# EasyEDA Pro project ProPrj_农_2025-09-07.epro, board PCB3
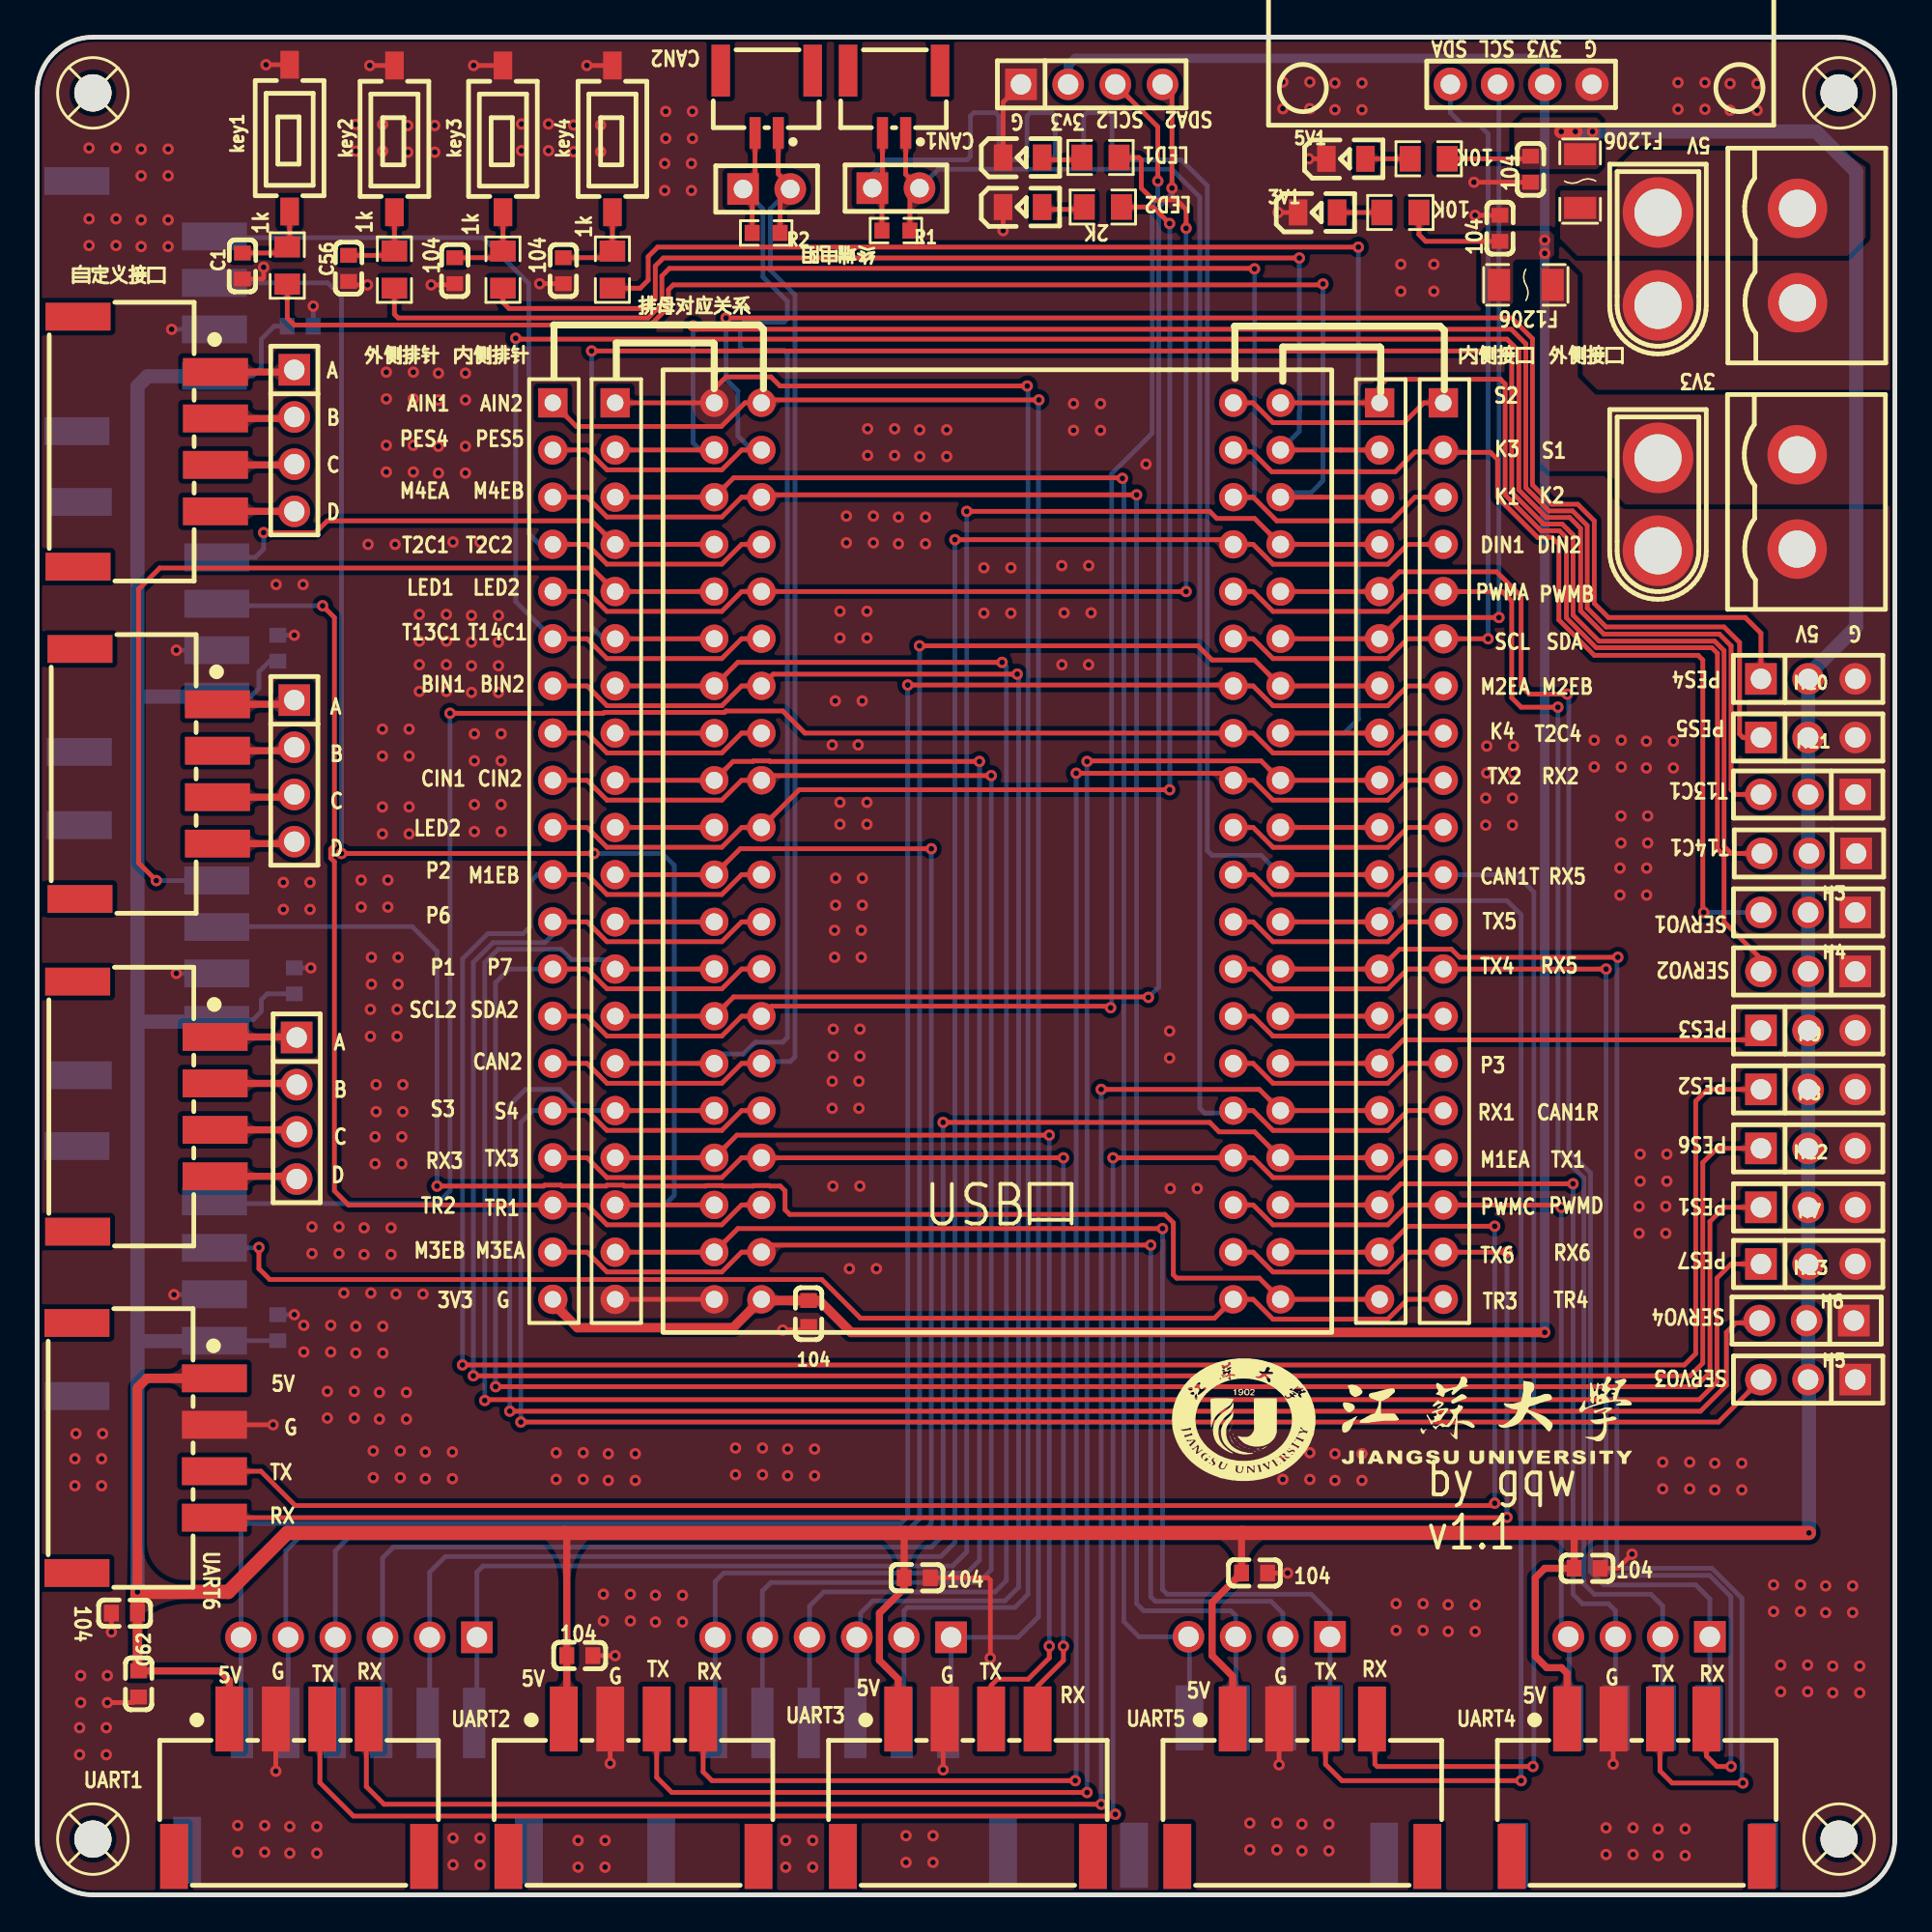
[diagram p8: board, top side]
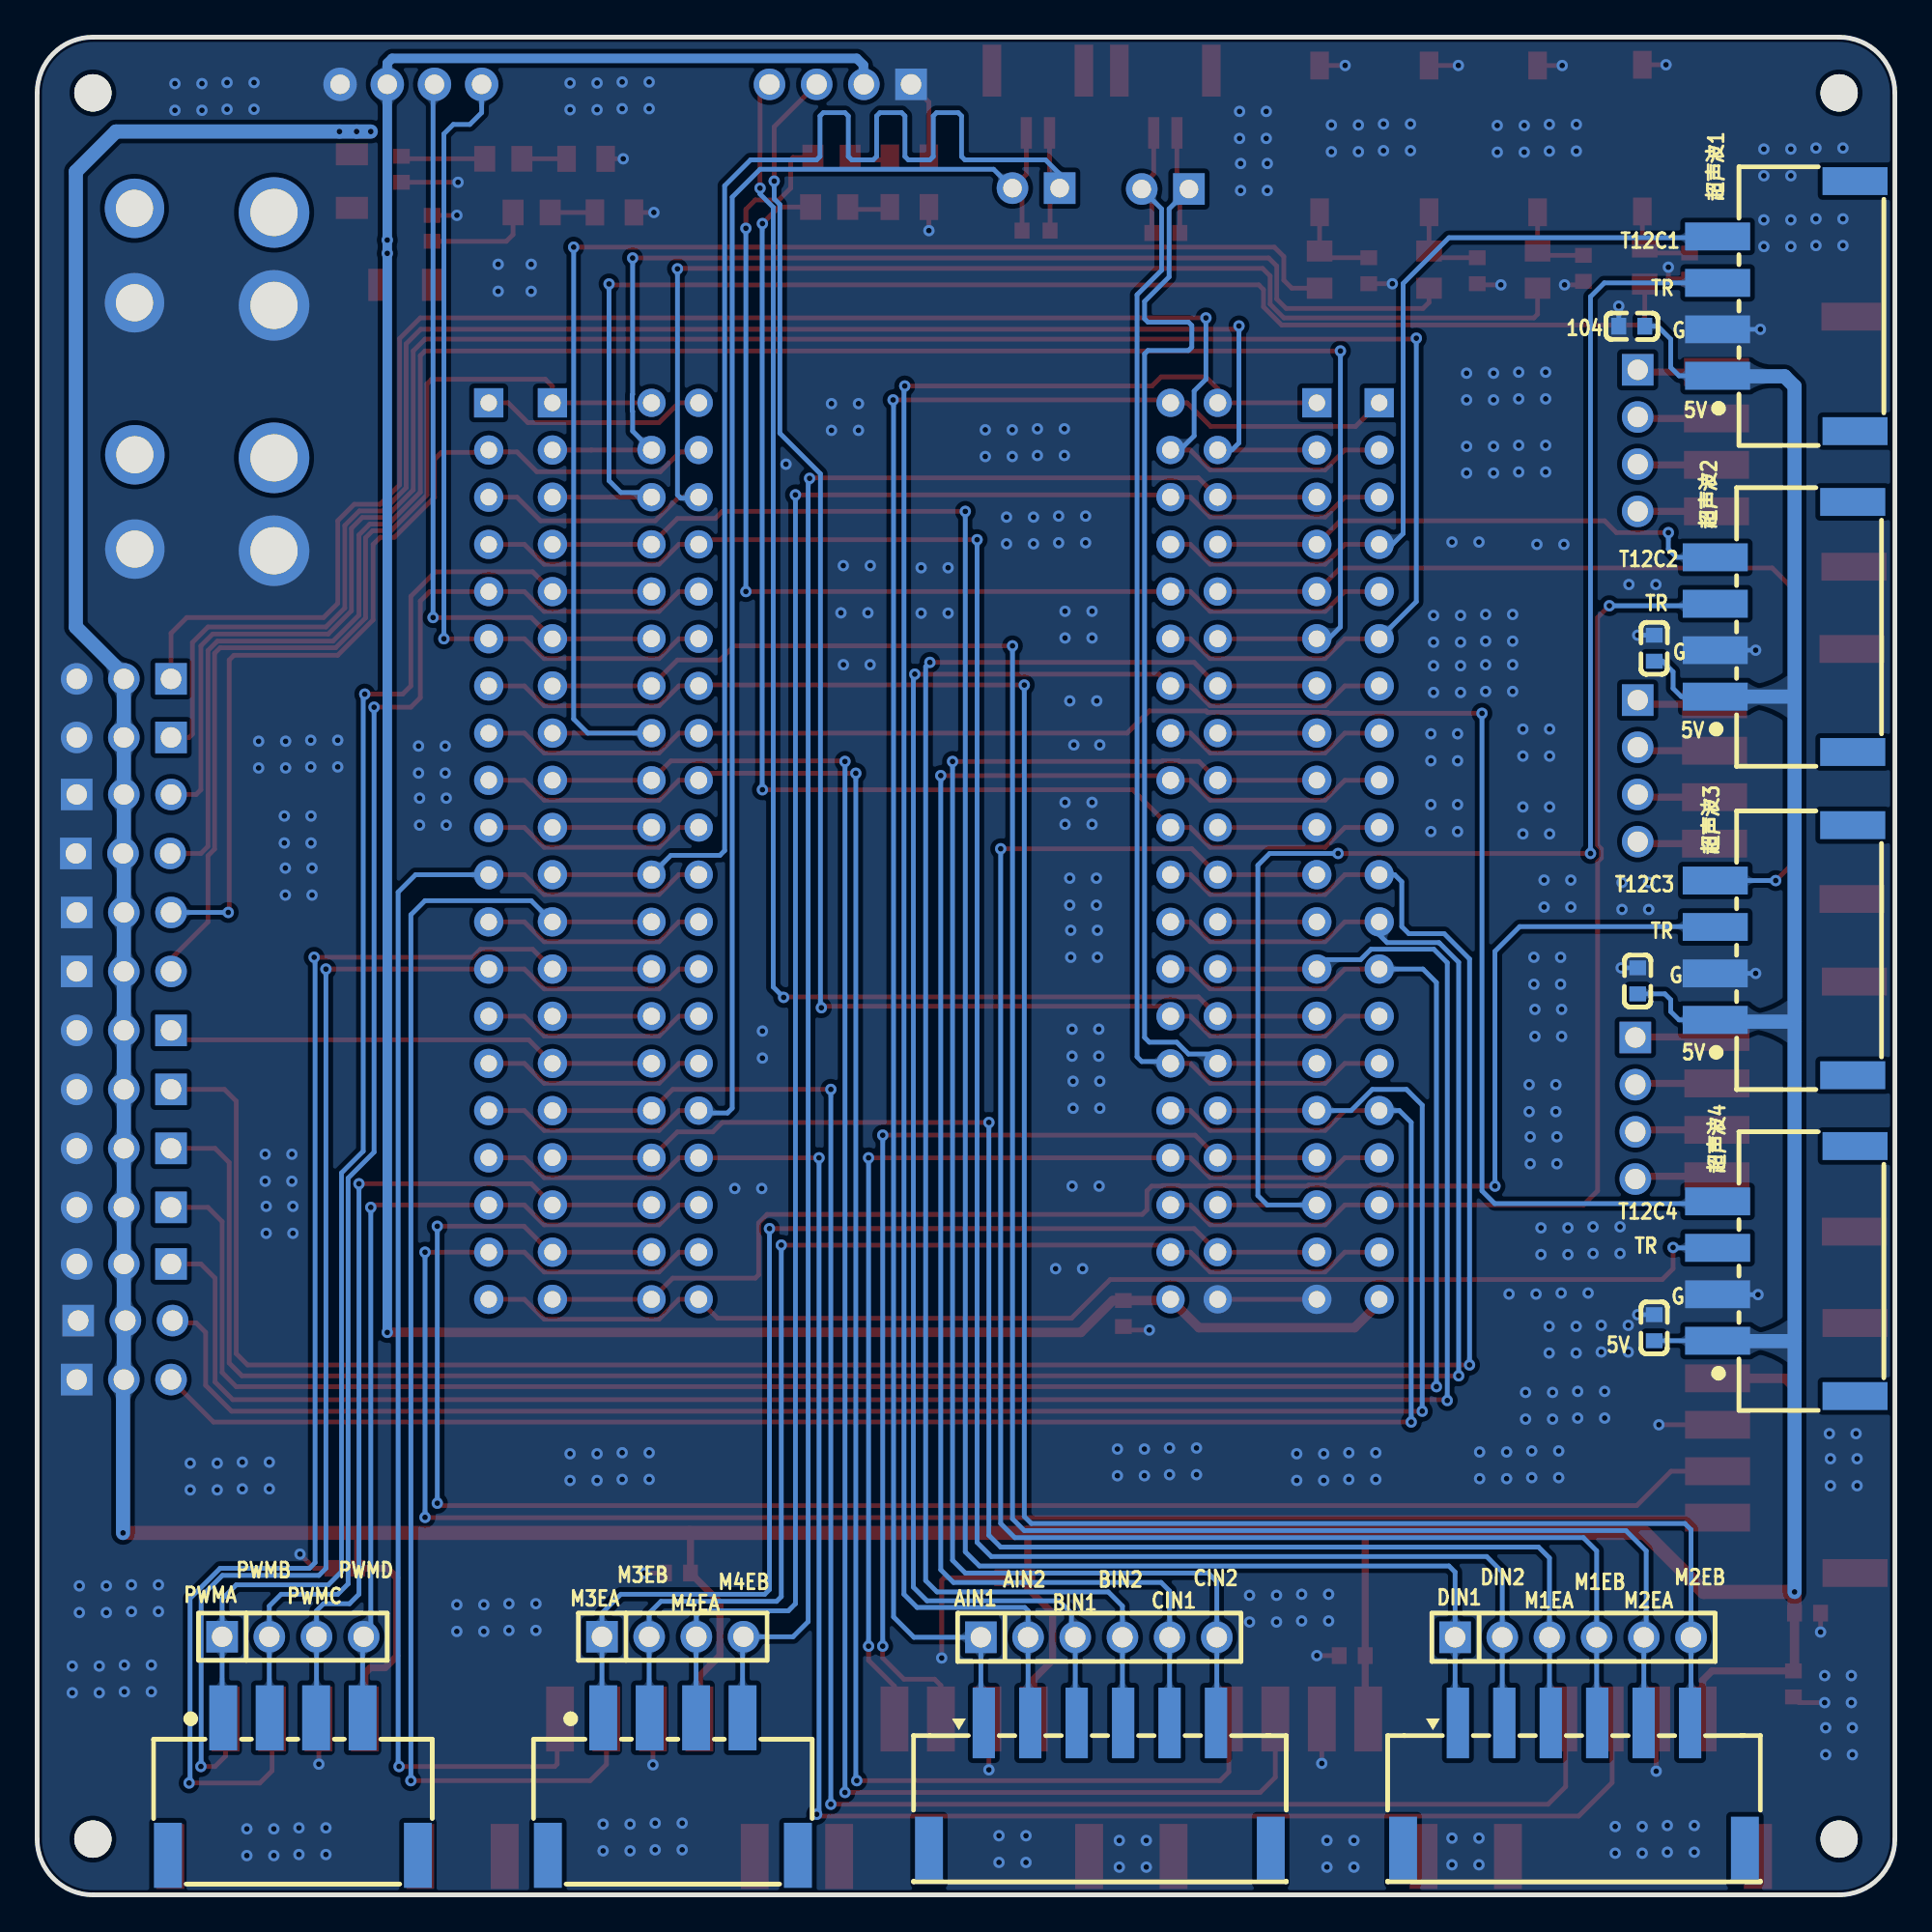
[diagram p9: board, bottom side, seen from below]

Outline 100 x 100 mm; copper layers: Top Layer, Bottom Layer. Coordinates in mm from the lower left corner of the outline.
Outline path: 0,97 0,3 arc(0.88,0.88) 3,0 97,0 arc(99.12,0.88) 100,3 100,97 arc(99.12,99.12) 97,100 3,100 arc(0.88,99.12) 0,97
Stack: Top Layer 0.035mm / Dielectric1 1.51mm FR4 er 4.5 / Bottom Layer 0.035mm

## Design rules (mm)
net CAN1_TX: DP2
net CAN1_RX: DP2
net CAN2_TX: DP1
net CAN2_RX: DP1
template: 自定义配置
spacing copperThickness1oz (default): track to track 0.102, other pairs 0.152 to 0.3
spacing copperThickness2oz: track to track 0.203, other pairs 0.152 to 0.3
track width copperThickness1oz (default): min 0.127, default 0.254, max 2.54
track width copperThickness2oz: min 0.203, default 0.254, max 2.54
differential pair differentialPair (default): width min 0.127, default 0.254, max 2.54; gap min 0.152, default 0.152
via viaSize (default): diameter min 0.5, default 0.61, max 10; hole min 0.3, default 0.305, max 6.299

## Placement (name value [footprint] x y rotation side)
3V1  NCD0805R1  [LED0805-R-RD]  68.93 90.56 0 top
5V1  NCD0805R1  [LED0805-R-RD]  70.45 93.45 0 top
104  104  [C0603]  41.53 31.29 90 top
C1  104  [C0603]  11.05 87.68 270 top
C13  104  [C0603]  78.74 89.71 270 top
C42  104  [C0603]  83.44 17.58 0 top
C56  104  [C0603]  16.76 87.55 270 top
C57  104  [C0603]  22.48 87.43 270 top
C58  104  [C0603]  28.32 87.43 270 top
C61  104  [C0603]  65.53 17.32 0 top
C62  104  [C0603]  5.46 11.35 270 top
C63  104  [C0603]  29.21 12.88 0 top
C64  104  [C0603]  47.37 17.07 0 top
C65  104  [C0603]  4.7 15.16 180 top
C66  104  [C0603]  13.84 49.2 90 bottom
C67  104  [C0603]  12.95 30.53 90 bottom
C68  104  [C0603]  12.95 67.11 90 bottom
C69  104  [C0603]  14.16 84.44 0 bottom
C70  104  [C0603]  80.39 92.89 90 top
CN17  WAFER-GH1.25-2PLB  [CONN-TH_2P-P1.25_XUNPU_WAFER-GH1.25-2PLB]  46.13 96.52 180 top
CN50  DB2EVC-5.08-2P-GN  [CONN-TH_2P-P5.08_DB2EVC-5.08-2P]  94.74 74.98 90 top
CN51  DB2EVC-5.08-2P-GN  [CONN-TH_2P-P5.08_DB2EVC-5.08-2P]  94.76 88.24 90 top
CN57  XT30U-M  [CONN-TH_XT30U-M]  87.25 88.06 270 top
CN59  XT30U-M  [CONN-TH_XT30U-M]  87.25 74.85 270 top
CN61  WAFER-XH2.54-4PWB  [CONN-TH_4P-P0.20_XUNPU_WAFER-XH2.54-4PWB]  86.23 5.83 180 bottom
CN62  WAFER-XH2.54-4PWB  [CONN-TH_4P-P0.20_XUNPU_WAFER-XH2.54-4PWB]  65.78 5.83 180 bottom
CN64  WAFER-GH1.25-2PLB  [CONN-TH_2P-P1.25_XUNPU_WAFER-GH1.25-2PLB]  39.27 96.52 180 top
CN65  WAFER-XH2.54-4PWB  [CONN-TH_4P-P0.20_XUNPU_WAFER-XH2.54-4PWB]  32.1 5.77 0 top
CN66  WAFER-XH2.54-4PWB  [CONN-TH_4P-P0.20_XUNPU_WAFER-XH2.54-4PWB]  50.1 5.77 0 top
CN67  WAFER-XH2.54-4PWB  [CONN-TH_4P-P0.20_XUNPU_WAFER-XH2.54-4PWB]  86.11 5.77 0 top
CN68  WAFER-XH2.54-4PWB  [CONN-TH_4P-P0.20_XUNPU_WAFER-XH2.54-4PWB]  68.1 5.77 0 top
CN69  WAFER-XH2.54-4PWB  [CONN-TH_4P-P0.20_XUNPU_WAFER-XH2.54-4PWB]  14.1 5.77 0 top
CN70  WAFER-XH2.54-4PWB  [CONN-TH_4P-P0.20_XUNPU_WAFER-XH2.54-4PWB]  5.84 24.05 270 top
CN72  WAFER-XH2.54-4PWB  [CONN-TH_4P-P0.20_XUNPU_WAFER-XH2.54-4PWB]  6.01 60.34 270 top
CN73  WAFER-XH2.54-4PWB  [CONN-TH_4P-P0.20_XUNPU_WAFER-XH2.54-4PWB]  5.88 42.43 270 top
CN75  WAFER-XH2.54-4PWB  [CONN-TH_4P-P0.20_XUNPU_WAFER-XH2.54-4PWB]  5.9 78.22 270 top
CN77  WAFER-XH2.54-4PWB  [CONN-TH_4P-P0.20_XUNPU_WAFER-XH2.54-4PWB]  5.84 85.52 90 bottom
CN78  WAFER-XH2.54-4PWB  [CONN-TH_4P-P0.20_XUNPU_WAFER-XH2.54-4PWB]  5.97 50.85 90 bottom
CN79  WAFER-XH2.54-4PWB  [CONN-TH_4P-P0.20_XUNPU_WAFER-XH2.54-4PWB]  5.97 68.25 90 bottom
CN80  WAFER-XH2.54-4PWB  [CONN-TH_4P-P0.20_XUNPU_WAFER-XH2.54-4PWB]  5.84 33.58 90 bottom
H3  PZ254V-11-03P  [HDR-TH_3P-P2.54-V-M]  95.33 52.88 180 top
H4  PZ254V-11-03P  [HDR-TH_3P-P2.54-V-M]  95.33 49.71 180 top
H5  PZ254V-11-03P  [HDR-TH_3P-P2.54-V-M]  95.33 27.74 180 top
H6  PZ254V-11-03P  [HDR-TH_3P-P2.54-V-M]  95.25 30.91 180 top
H7  PZ254V-11-03P  [HDR-TH_3P-P2.54-V-M]  95.33 37.01 0 top
H8  PZ254V-11-03P  [HDR-TH_3P-P2.54-V-M]  95.33 43.36 0 top
H9  PZ254V-11-03P  [HDR-TH_3P-P2.54-V-M]  95.33 46.53 0 top
H10  PZ254V-11-03P  [HDR-TH_3P-P2.54-V-M]  95.33 65.46 0 top
H11  PZ254V-11-03P  [HDR-TH_3P-P2.54-V-M]  95.33 62.3 0 top
H12  PZ254V-11-03P  [HDR-TH_3P-P2.54-V-M]  95.33 40.18 0 top
H13  PZ254V-11-03P  [HDR-TH_3P-P2.54-V-M]  95.33 33.96 0 top
H14  PZ254V-11-04P  [HDR-TH_4P-P2.54-V-M]  56.77 97.46 0 top
H15  -  [HDR-TH_2P-P2.54-V-F]  46.23 91.87 0 top
H16  -  [HDR-TH_2P-P2.54-V-F]  39.27 91.83 0 top
H17  PZ254V-11-04P  [HDR-TH_4P-P2.54-V-M]  86.23 13.89 180 bottom
H18  PZ254V-11-04P  [HDR-TH_4P-P2.54-V-M]  65.79 13.89 180 bottom
H19  2.54-1*6-BLUE  [HDR-TH_6P-P2.54-V-M_BLUE]  17.32 13.86 180 bottom
H20  2.54-1*6-BLUE  [HDR-TH_6P-P2.54-V-M_BLUE]  42.85 13.86 180 bottom
H21  PZ254V-11-04P  [HDR-TH_4P-P2.54-V-M]  13.84 60.5 270 top
H22  PZ254V-11-04P  [HDR-TH_4P-P2.54-V-M]  13.97 42.34 270 top
H23  PZ254V-11-03P  [HDR-TH_3P-P2.54-V-M]  95.33 59.23 180 top
H24  PZ254V-11-03P  [HDR-TH_3P-P2.54-V-M]  95.38 56.06 180 top
H26  PZ254V-11-04P  [HDR-TH_4P-P2.54-V-M]  13.84 78.28 270 top
J1  HDR-M-2.54_1x20  [HDR-M-2.54_1X20]  31.12 56.19 270 top
J2  HDR-M-2.54_1x20  [HDR-M-2.54_1X20]  27.76 56.19 270 top
J3  HDR-M-2.54_1x20  [HDR-M-2.54_1X20]  75.69 56.19 270 top
J4  HDR-M-2.54_1x20  [HDR-M-2.54_1X20]  72.26 56.19 270 top
key1  TS-1092S-B3D2-G  [SW-SMD_L6.1-W3.6-LS7.9]  13.59 94.56 90 top
key2  TS-1092S-B3D2-G  [SW-SMD_L6.1-W3.6-LS7.9]  19.23 94.52 90 top
key3  TS-1092S-B3D2-G  [SW-SMD_L6.1-W3.6-LS7.9]  25.07 94.52 90 top
key4  TS-1092S-B3D2-G  [SW-SMD_L6.1-W3.6-LS7.9]  30.97 94.52 90 top
LED1  NCD0805R1  [LED0805-R-RD]  53.05 93.52 0 top
LED2  NCD0805R1  [LED0805-R-RD]  53.05 90.86 0 top
R1  120  [R0603]  46.23 89.59 180 top
R2  120  [R0603]  39.24 89.46 180 top
R6_1k1  1K  [R0805]  13.46 87.71 90 top
R7_1K1  1K  [R0805]  19.23 87.49 90 top
R8_1K1  1K  [R0805]  25.07 87.49 90 top
R10_2K1  2K  [R0805]  57.37 90.86 180 top
R10_10K1  10K  [R0805]  73.38 90.56 180 top
R13_2K1  2K  [R0805]  57.24 93.52 180 top
R13_10K1  10K  [R0805]  74.91 93.45 180 top
R31_1K1  1K  [R0805]  30.97 87.49 90 top
SCREW1  -  [M2螺丝]  97 3 0 top
SCREW2  -  [M2螺丝]  3 3 0 top
SCREW3  -  [M2螺丝]  97 97 0 top
SCREW4  -  [M2螺丝]  3 97 0 top
U1  -  [stm32f4最小]  33.69 82.09 0 top
U31  HS96L03W2C03  [OLED-TH_L27.8-W27.2-P2.54_C9900033791]  79.88 97.46 180 top
U35  2.54-6PWT  [COMM-SMD_6P-P2.50_SHOUHAN_2.54-6PWT]  42.79 5.83 180 bottom
U36  2.54-6PWT  [COMM-SMD_6P-P2.50_SHOUHAN_2.54-6PWT]  17.27 5.83 180 bottom
U37  1.5A快恢复保险丝-1206  [F1206]  80.14 86.67 180 top
U38  1.5A快恢复保险丝-1206  [F1206]  83.06 92.25 90 top

## Footprints (pads in the part's own frame, mm; a bottom-side part is the same pattern mirrored in y, then rotated)
C0603
  rect 0.8x0.9 smd: 1(-0.7,0) 2(0.7,0)
COMM-SMD_6P-P2.50_SHOUHAN_2.54-6PWT
  rect 1.2x3.8 smd: 1(-6.25,3.425) 2(-3.75,3.425) 3(-1.25,3.425) 4(1.25,3.425) 5(3.75,3.425) 6(6.25,3.425)
  rect 1.5x3.6 smd: 7(9.2,-3.425) 8(-9.2,-3.425)
CONN-TH_2P-P1.25_XUNPU_WAFER-GH1.25-2PLB
  rect 0.6x1.7 smd: 1(-0.625,1.675) 2(0.625,1.675)
  rect 1x2.8 smd: 3(2.475,-1.675) 4(-2.475,-1.675)
CONN-TH_2P-P5.08_DB2EVC-5.08-2P
  round 3.2 hole 2: 1(-2.54,0) 2(2.54,0)
CONN-TH_4P-P0.20_XUNPU_WAFER-XH2.54-4PWB
  rect 1.5x3.5 smd: 1(-3.75,3.7) 2(-1.25,3.7) 3(1.25,3.7) 4(3.75,3.7) 5(-6.73,-3.7) 6(6.73,-3.7)
CONN-TH_XT30U-M
  round 3.8 hole 2.54: 1(-2.5,0) 2(2.5,0)
F1206
  rect 1.19x1.728 smd: 1(-1.445,0) 2(1.445,0)
HDR-M-2.54_1X20
  rect 1.575x1.575 hole 0.889: 1(-24.13,0)
  round 1.575 hole 0.889: 2(-21.59,0) 3(-19.05,0) 4(-16.51,0) 5(-13.97,0) 6(-11.43,0) 7(-8.89,0) 8(-6.35,0) 9(-3.81,0) 10(-1.27,0) 11(1.27,0) 12(3.81,0) 13(6.35,0) 14(8.89,0) 15(11.43,0) 16(13.97,0) 17(16.51,0) 18(19.05,0) 19(21.59,0) 20(24.13,0)
HDR-TH_2P-P2.54-V-F
  rect 1.7x1.7 hole 1: 1(-1.27,0)
  round 1.7 hole 1: 2(1.27,0)
HDR-TH_3P-P2.54-V-M
  rect 1.7x1.7 hole 1.1: 1(-2.54,0)
  round 1.7 hole 1.1: 2(0,0) 3(2.54,0)
HDR-TH_4P-P2.54-V-M
  rect 1.7x1.7 hole 1.1: 1(-3.81,0)
  round 1.7 hole 1.1: 2(-1.27,0) 3(1.27,0) 4(3.81,0)
HDR-TH_6P-P2.54-V-M_BLUE
  rect 1.7x1.7 hole 1.1: 1(-6.35,0)
  round 1.7 hole 1.1: 2(-3.81,0) 3(-1.27,0) 4(1.27,0) 5(3.81,0) 6(6.35,0)
LED0805-R-RD
  rect 1x1.399 smd: 1(1.05,0) 2(-1.05,0)
M2螺丝
  round 2 hole 2: 1(0,0)
OLED-TH_L27.8-W27.2-P2.54_C9900033791
  round 1.8 hole 1.05: 1(-3.81,0) 2(-1.27,0) 3(1.27,0) 4(3.81,0)
R0603
  rect 0.806x0.864 smd: 1(-0.753,0) 2(0.753,0)
R0805
  rect 1.133x1.377 smd: 1(-1,0) 2(1,0)
stm32f4最小
  round 1.524 hole 0.914: 1(2.76,-1.778) 2(2.76,-4.318) 3(2.76,-6.858) 4(2.76,-9.398) 5(2.76,-11.938) 6(2.76,-14.478) 7(2.76,-17.018) 8(2.76,-19.558) 9(2.76,-22.098) 10(2.76,-24.638) 11(2.76,-27.178) 12(2.76,-29.718) 13(2.76,-32.258) 14(2.76,-34.798) 15(2.76,-37.338) 16(2.76,-39.878) 17(2.76,-42.418) 18(2.76,-44.958) 19(2.76,-47.498) 20(2.76,-50.038) 21(5.3,-1.778) 22(5.3,-4.318) 23(5.3,-6.858) 24(5.3,-9.398) 25(5.3,-11.938) 26(5.3,-14.478) 27(5.3,-17.018) 28(5.3,-19.558) 29(5.3,-22.098) 30(5.3,-24.638) 31(5.3,-27.178) 32(5.3,-29.718) 33(5.3,-32.258) 34(5.3,-34.798) 35(5.3,-37.338) 36(5.3,-39.878) 37(5.3,-42.418) 38(5.3,-44.958) 39(5.3,-47.498) 40(5.3,-50.038) 41(30.7,-1.778) 42(30.7,-4.318) 43(30.7,-6.858) 44(30.7,-9.398) 45(30.7,-11.938) 46(30.7,-14.478) 47(30.7,-17.018) 48(30.7,-19.558) 49(30.7,-22.098) 50(30.7,-24.638) 51(30.7,-27.178) 52(30.7,-29.718) 53(30.7,-32.258) 54(30.7,-34.798) 55(30.7,-37.338) 56(30.7,-39.878) 57(30.7,-42.418) 58(30.7,-44.958) 59(30.7,-47.498) 60(30.7,-50.038) 61(33.24,-1.778) 62(33.24,-4.318) 63(33.24,-6.858) 64(33.24,-9.398) 65(33.24,-11.938) 66(33.24,-14.478) 67(33.24,-17.018) 68(33.24,-19.558) 69(33.24,-22.098) 70(33.24,-24.638) 71(33.24,-27.178) 72(33.24,-29.718) 73(33.24,-32.258) 74(33.24,-34.798) 75(33.24,-37.338) 76(33.24,-39.878) 77(33.24,-42.418) 78(33.24,-44.958) 79(33.24,-47.498) 80(33.24,-50.038)
SW-SMD_L6.1-W3.6-LS7.9
  rect 1.5x1 smd: 1(-3.95,0) 2(3.95,0)

## Nets
3V3: 104.2 C13.2 H14.2 J2.20 R10_10K1.1 U1.40 U31.2 U37.2
5V: C42.1 C61.1 C62.1 C63.1 C64.1 C65.1 C66.1 C67.1 C68.1 C69.1 C70.2 CN65.1 CN66.1 CN67.1 CN68.1 CN69.1 CN70.1 CN77.1 CN78.1 CN79.1 CN80.1 H3.2 H4.2 H5.2 H6.2 H7.2 H8.2 H9.2 H10.2 H11.2 H12.2 H13.2 H23.2 H24.2 R13_10K1.1 U38.2
GND: 3V1.2 5V1.2 104.1 C1.2 C13.1 C42.2 C56.2 C57.2 C58.2 C61.2 C62.2 C63.2 C64.2 C65.2 C66.2 C67.2 C68.2 C69.2 C70.1 CN50.1 CN51.1 CN57.2 CN59.2 CN65.2 CN66.2 CN67.2 CN68.2 CN69.2 CN70.2 CN77.2 CN78.2 CN79.2 CN80.2 H3.1 H4.1 H5.1 H6.1 H7.3 H8.3 H9.3 H10.3 H11.3 H12.3 H13.3 H14.1 H23.1 H24.1 J1.20 key1.2 key2.2 key3.2 key4.2 LED1.2 LED2.2 U1.20 U31.1
AIN1: H20.1 J2.1 U1.21 U35.1
AIN2: H20.2 J1.1 U1.1 U35.2
BIN1: H20.3 J2.7 U1.27 U35.3
BIN2: H20.4 J1.7 U1.7 U35.4
CAN1_RX: CN17.1 H15.2 J3.16 R1.1 U1.56
CAN1_TX: CN17.2 H15.1 J4.11 R1.2 U1.71
CAN2_RX: CN64.1 H16.2 J2.15 R2.1 U1.35
CAN2_TX: CN64.2 H16.1 J1.15 R2.2 U1.15
CIN1: H20.5 J2.9 U1.29 U35.5
CIN2: H20.6 J1.9 U1.9 U35.6
DIN1: H19.1 J4.4 U1.64 U36.1
DIN2: H19.2 J3.4 U1.44 U36.2
KEY1: J4.3 R6_1k1.1 U1.63
KEY2: J3.3 R7_1K1.1 U1.43
KEY3: J4.2 R8_1K1.1 U1.62
KEY4: J4.8 R31_1K1.1 U1.68
LED1: J2.5 R13_2K1.1 U1.25
LED2: J2.10 R10_2K1.1 U1.30
M1_ENCODER_A: H19.3 J4.17 U1.77 U36.3
M1_ENCODER_B: H19.4 J1.11 U1.11 U36.4
M2_ENCODER_A: H19.5 J4.7 U1.67 U36.5
M2_ENCODER_B: H19.6 J3.7 U1.47 U36.6
M3_ENCODER_A: CN62.1 H18.1 J1.19 U1.19
M3_ENCODER_B: CN62.2 H18.2 J2.19 U1.39
M4_ENCODER_A: CN62.3 H18.3 J2.3 U1.23
M4_ENCODER_B: CN62.4 H18.4 J1.3 U1.3
PES1: H7.1 J2.13 U1.33
PES2: H8.1 J2.11 U1.31
PES3: H9.1 J4.15 U1.75
PES4: H10.1 J2.2 U1.22
PES5: H11.1 J1.2 U1.2
PES6: H12.1 J2.12 U1.32
PES7: H13.1 J1.13 U1.13
PWMA: CN61.1 H17.1 J4.5 U1.65
PWMB: CN61.2 H17.2 J3.5 U1.45
PWMC: CN61.3 H17.3 J4.18 U1.78
PWMD: CN61.4 H17.4 J3.18 U1.58
RX1: CN69.4 J4.16 U1.76
RX2: CN65.4 J3.9 U1.49
RX3: CN66.4 J2.17 U1.37
RX4: CN67.4 J3.13 U1.53
RX5: CN68.4 J3.11 U1.51
RX6: CN70.4 J3.19 U1.59
SCL: J4.6 U1.66 U31.3
SCL2: H14.3 J2.14 U1.34
SDA: J3.6 U1.46 U31.4
SDA2: H14.4 J1.14 U1.14
SERVO1: H3.3 J3.2 U1.42
SERVO2: H4.3 J4.1 U1.61
SERVO3: H5.3 J2.16 U1.36
SERVO4: H6.3 J1.16 U1.16
T13C1: H23.3 J2.6 U1.26
T14C1: H24.3 J1.6 U1.6
TIM2C1: CN77.4 J2.4 U1.24
TIM2C2: CN79.4 J1.4 U1.4
TIM2C3: CN78.4 J1.5 U1.5
TIM2C4: CN80.4 J3.8 U1.48
TRIGGER1: CN77.3 J1.18 U1.18
TRIGGER2: CN79.3 J2.18 U1.38
TRIGGER3: CN78.3 J4.20 U1.80
TRIGGER4: CN80.3 J3.20 U1.60
TX1: CN69.3 J3.17 U1.57
TX2: CN65.3 J4.9 U1.69
TX3: CN66.3 J1.17 U1.17
TX4: CN67.3 J4.13 U1.73
TX5: CN68.3 J4.12 U1.72
TX6: CN70.3 J4.19 U1.79
USER1_A: CN72.1 H21.1
USER1_B: CN72.2 H21.2
USER1_C: CN72.3 H21.3
USER1_D: CN72.4 H21.4
USER2_A: CN73.1 H22.1
USER2_B: CN73.2 H22.2
USER2_C: CN73.3 H22.3
USER2_D: CN73.4 H22.4
USER3_A: CN75.1 H26.1
USER3_B: CN75.2 H26.2
USER3_C: CN75.3 H26.3
USER3_D: CN75.4 H26.4
$1N365: J3.14 U1.54
$1N367: J3.15 U1.55
$1N369: J4.14 U1.74
$1N397: J3.1 U1.41
$1N415: J1.10 U1.10
$1N423: J1.12 U1.12
$1N429: J2.8 U1.28
$1N431: J1.8 U1.8
$1N459: J3.12 U1.52
$1N465: J3.10 U1.50
$1N768: CN50.2 CN59.1 U37.1
$1N1772: CN51.2 CN57.1 U38.1
$1N5729: J4.10 U1.70
$1N6571: C1.1 key1.1 R6_1k1.2
$1N6572: C56.1 key2.1 R7_1K1.2
$1N6573: C57.1 key3.1 R8_1K1.2
$1N6581: C58.1 key4.1 R31_1K1.2
$1N6590: LED2.1 R10_2K1.2
$1N6594: LED1.1 R13_2K1.2
$1N12392: 3V1.1 R10_10K1.2
$1N12395: 5V1.1 R13_10K1.2

Pads without a net: CN17 3 4; CN61 5 6; CN62 5 6; CN64 3 4; CN65 5 6; CN66 5 6; CN67 5 6; CN68 5 6; CN69 5 6; CN70 5 6; CN72 5 6; CN73 5 6; CN75 5 6; CN77 5 6; CN78 5 6; CN79 5 6; CN80 5 6; SCREW1 1; SCREW2 1; SCREW3 1; SCREW4 1; U35 7 8; U36 7 8

## Via types
v1: diameter 0.61, hole 0.305, Top Layer to Bottom Layer, 505 vias

## Routing (per net, layer and track width the routed paths; a pad name or vN(x,y) marks a point on that pad's centre or on a via; arc(x,y) is an arc through that point)
3V3: length 156.5
  Top Layer w0.254: R10_10K1.1 74.38,89.37 74.74,89.01 C13.2
  Top Layer w0.508: J2.20 27.76,31.86 29.08,30.53 37.46,30.53 U1.40 39.05,31.99 104.2 42.1,31.99 43.81,30.28 v1(81.15,30.28)
  Bottom Layer w0.508: H14.2 55.52,97.48 55.52,98.5 55.88,98.86 80.9,98.86 81.15,98.6 v1(81.15,89.08) v1(81.15,88.36) v1(81.15,30.28)
5V: length 360.9
  Top Layer w0.254: R13_10K1.1 80.25,93.45 C70.2
  Top Layer w0.381: CN67.1 82.36,11.93 82.06,12.23 81.26,12.23 80.65,12.85 80.65,17.07 81.15,17.58 C42.1 82.74,19.44 82.78,19.48 ; 28.4,19.48 28.51,19.37 C63.1 28.51,9.63 28.35,9.47 ; 64.88,19.48 64.83,19.43 C61.1 63.25,15.74 63.25,12.88 64.35,11.77 CN68.1 ; C62.1 9.84,12.05 10.35,11.55 CN69.1 ; CN66.1 46.35,11.61 45.34,12.62 45.34,15.16 46.67,16.5 C64.1 46.67,19.47 46.69,19.48
  Top Layer w0.508: 5.46,27.36 5.91,27.8 CN70.1 ; C65.1 5.4,11.99 5.46,11.93 ; v1(5.4,16.31) 5.4,27.29
  Top Layer w0.762: v1(95.38,19.48) 13.46,19.48 10.29,16.31 v1(5.4,16.31) C65.1 ; v1(82.8,94.92) v1(82.04,94.92)
  Bottom Layer w0.254: C68.1 12.51,66.41 11.94,65.84 11.94,64.95 11.49,64.5 CN79.1 ; CN77.1 11.62,81.77 12.06,82.22 12.06,83.74 12.76,84.44 C69.1 ; 12.95,29.83 12.95,29.83 CN80.1 ; CN78.1 11.62,47.1 12.06,47.55 12.06,48.18 12.38,48.5 C66.1
  Bottom Layer w0.762: v1(82.04,94.92) v1(82.8,94.92) v1(83.73,94.92) 95.76,94.92 97.92,92.76 97.92,68.25 95.33,65.67 H10.2 H11.2 H23.2 H3.2 H4.2 H9.2 H8.2 H12.2 H7.2 H13.2 H5.2 ; 5.4,47.01 9.57,47.01 CN78.1 ; 5.4,47.01 5.4,64.5 ; 5.4,47.01 5.4,29.81 ; 5.4,64.5 CN79.1 ; 5.4,64.5 5.4,81.2 5.94,81.74 9.51,81.74 CN77.1 ; v1(5.4,16.31) 5.4,29.81 ; 5.4,29.81 9.52,29.81 CN80.1 ; 95.38,27.74 v1(95.38,19.48)
GND: length 67.8
  Top Layer w0.254: C58.2 v1(27.05,86.73) ; C63.2 v1(31.12,12.88) ; v1(40.13,30.4) 41.34,30.4 41.53,30.59 ; C61.2 v1(67.31,17.32) ; C13.1 v1(77.41,90.41) ; C70.1 v1(77.34,92.19) ; v1(21.21,86.67) 22.42,86.67 C57.2 ; C65.2 v1(4,14.15) ; 30.85,8.28 v1(30.85,7.08) ; 3V1.2 v1(66.8,90.56) ; 84.14,17.58 85.09,17.58 v1(85.85,18.34) ; U1.20 J1.20 ; key4.2 30.96,98.48 v1(29.59,98.48) ; C62.2 5.16,10.35 v1(3.78,10.35) ; key1.2 v1(12.32,98.51) ; 66.85,8.21 v1(66.85,7) ; LED2.2 v1(52,89.59) ; CN69.2 v1(12.85,6.66) ; v1(23.5,98.48) 25.07,98.48 key3.2 ; C56.2 16.95,86.67 v1(17.78,86.67) ; 48.77,7.99 v1(48.77,6.73) ; C64.2 51.18,17.07 51.31,16.94 v1(51.31,12.75) ; v1(12.19,87.62) 12.19,87.05 12.13,86.98 C1.2 ; key2.2 v1(17.91,98.47) ; 5V1.2 v1(68.45,93.45) ; CN70.2 v1(12.7,25.3) ; LED1.2 52,96.5 H14.1 ; 84.84,8.24 v1(84.84,7.04)
  Bottom Layer w0.254: C69.2 v1(14.86,85.52) ; C67.2 v1(13.84,31.23) ; CN79.2 v1(7.49,67) ; CN77.2 v1(7.24,84.27) ; C66.2 v1(14.73,49.9) ; C68.2 v1(13.84,67.81) ; v1(7.37,32.31) 9.52,32.31 CN80.2 ; CN78.2 v1(7.49,49.6)
  vias: v1(2.03,23.47) v1(2.03,22.02) v1(2.09,24.83) v1(2.34,11.8) v1(2.34,10.35) v1(2.29,9) v1(2.29,7.54) v1(2.79,94.03) v1(2.79,90.22) v1(2.79,88.78) v1(3.52,24.83) v1(3.47,23.47) v1(3.47,22.02) v1(3.72,9) v1(3.72,7.54) v1(3.78,11.8) v1(4.25,94.03) v1(4.25,90.22) v1(4.25,88.78) v1(5.6,93.98) v1(5.6,92.54) v1(5.6,90.17) v1(5.6,88.73) v1(7.05,93.98) v1(7.05,92.54) v1(7.05,90.17) v1(7.05,88.73) v1(10.8,3.73) v1(10.8,2.3) v1(12.25,3.73) v1(12.25,2.3) v1(12.86,70.54) v1(13.25,54.5) v1(13.25,53.05) v1(13.6,3.68) v1(13.6,2.24) v1(14.32,70.54) v1(14.35,30.66) v1(14.35,29.22) v1(14.69,54.5) v1(14.69,53.05) v1(14.79,35.96) v1(14.79,34.52) v1(15.05,3.68) v1(15.05,2.24) v1(15.62,27.1) v1(15.62,25.66) v1(15.8,30.66) v1(15.8,29.22) v1(16.25,35.96) v1(16.25,34.52) v1(16.51,32.4) v1(17.14,95.3) v1(17.14,93.86) v1(17.07,27.1) v1(17.07,25.66) v1(17.16,30.6) v1(17.16,29.17) v1(17.44,54.63) v1(17.44,53.17) v1(17.6,35.91) v1(17.6,34.47) v1(17.82,72.69) v1(17.94,47.67) v1(17.94,46.21) v1(17.99,50.47) v1(17.99,49.02) v1(17.96,32.4) v1(18.09,23.9) v1(18.09,22.46) v1(18.25,43.61) v1(18.25,42.16) v1(18.19,40.81) v1(18.19,39.35) v1(18.43,27.05) v1(18.43,25.61) v1(18.6,95.3) v1(18.6,93.86) v1(18.59,62.75) v1(18.59,61.3) v1(18.59,58.56) v1(18.59,57.11) v1(18.61,30.6) v1(18.61,29.17) v1(18.8,81.97) v1(18.8,80.53) v1(18.8,78.03) v1(18.8,76.59) v1(18.88,54.63) v1(18.88,53.17) v1(19.05,35.91) v1(19.05,34.47) v1(19.27,72.69) v1(19.31,32.34) v1(19.43,50.47) v1(19.43,49.02) v1(19.38,47.67) v1(19.38,46.21) v1(19.55,23.9) v1(19.55,22.46) v1(19.63,40.81) v1(19.63,39.35) v1(19.69,43.61) v1(19.69,42.16) v1(19.95,95.25) v1(19.95,93.81) v1(19.88,27.05) v1(19.88,25.61) v1(20.02,62.75) v1(20.02,61.3) v1(20.02,58.56) v1(20.02,57.11) v1(20.25,81.97) v1(20.25,80.53) v1(20.25,78.03) v1(20.25,76.59) v1(20.57,68.92) v1(20.57,67.49) v1(20.57,66.22) v1(20.57,64.78) v1(20.77,32.34) v1(20.9,23.84) v1(20.9,22.4) v1(21.4,95.25) v1(21.4,93.81) v1(21.6,81.91) v1(21.6,80.47) v1(21.6,77.97) v1(21.6,76.54) v1(22.03,68.92) v1(22.03,67.49) v1(22.03,66.22) v1(22.03,64.78) v1(22.39,72.82) v1(22.35,23.84) v1(22.35,22.4) v1(22.39,3.06) v1(22.39,1.62) v1(23.05,81.91) v1(23.05,80.47) v1(23.05,77.97) v1(23.05,76.54) v1(23.38,68.87) v1(23.38,67.43) v1(23.38,66.16) v1(23.38,64.73) v1(23.54,62.5) v1(23.54,61.05) v1(23.54,58.69) v1(23.54,57.24) v1(23.84,72.82) v1(23.84,3.06) v1(23.84,1.62) v1(24.83,68.87) v1(24.83,67.43) v1(24.83,66.16) v1(24.83,64.73) v1(24.98,62.5) v1(24.98,61.05) v1(24.98,58.69) v1(24.98,57.24) v1(26.07,95.33) v1(26.07,93.89) v1(27.53,95.33) v1(27.53,93.89) v1(27.94,23.8) v1(27.94,22.36) v1(28.88,95.27) v1(28.88,93.83) v1(29.12,2.93) v1(29.12,1.49) v1(29.39,23.8) v1(29.39,22.36) v1(30.33,95.27) v1(30.33,93.83) v1(30.48,16.18) v1(30.48,14.74) v1(30.57,2.93) v1(30.57,1.49) v1(30.74,23.74) v1(30.74,22.31) v1(31.93,16.18) v1(31.93,14.74) v1(32.2,23.74) v1(32.2,22.31) v1(33.28,16.12) v1(33.28,14.69) v1(33.84,96) v1(33.84,94.55) v1(33.78,93.2) v1(33.78,91.75) v1(34.74,16.12) v1(34.74,14.69) v1(35.22,93.2) v1(35.22,91.75) v1(35.27,96) v1(35.27,94.55) v1(37.59,24.05) v1(37.59,22.62) v1(39.04,24.05) v1(39.04,22.62) v1(40.29,2.93) v1(40.29,1.49) v1(40.4,24) v1(40.4,22.56) v1(41.75,2.93) v1(41.75,1.49) v1(41.85,24) v1(41.85,22.56) v1(42.8,61.9) v1(42.8,43.8) v1(42.8,42.34) v1(42.83,38.15) v1(42.93,51.92) v1(42.93,50.47) v1(42.85,46.6) v1(42.85,45.15) v1(42.96,64.27) v1(42.98,54.73) v1(42.98,53.27) v1(43.22,69.1) v1(43.22,67.66) v1(43.22,58.81) v1(43.22,57.63) v1(43.56,74.22) v1(43.56,72.78) v1(43.72,33.71) v1(44.2,61.9) v1(44.24,43.8) v1(44.24,42.34) v1(44.29,46.6) v1(44.29,45.15) v1(44.29,38.15) v1(44.41,64.27) v1(44.42,54.73) v1(44.42,53.27) v1(44.36,51.92) v1(44.36,50.47) v1(44.7,78.92) v1(44.7,77.48) v1(44.67,69.1) v1(44.67,67.66) v1(44.67,58.81) v1(44.67,57.63) v1(45.01,74.22) v1(45.01,72.78) v1(45.18,33.71) v1(46.16,78.92) v1(46.16,77.48) v1(46.37,74.16) v1(46.37,72.73) v1(46.77,3.18) v1(46.77,1.75) v1(47.51,78.86) v1(47.51,77.43) v1(47.82,74.16) v1(47.82,72.73) v1(48.22,3.18) v1(48.22,1.75) v1(48.96,78.86) v1(48.96,77.43) v1(50.96,71.44) v1(50.96,68.99) v1(52.42,71.44) v1(52.42,68.99) v1(55.15,71.55) v1(55.16,66.22) v1(55.28,69.01) v1(55.79,80.27) v1(55.79,78.83) v1(56.61,71.55) v1(56.6,66.22) v1(56.73,69.01) v1(57.24,80.27) v1(57.24,78.83) v1(59.69,77.01) v1(60.96,46.5) v1(60.96,45.04) v1(61,38.02) v1(62.45,38.02) v1(65.28,3.86) v1(65.28,2.42) v1(66.73,3.86) v1(66.73,2.42) v1(67.06,97.59) v1(67.06,96.15) v1(67.06,23.8) v1(67.06,22.36) v1(68.08,3.81) v1(68.08,2.37) v1(68.51,97.59) v1(68.51,96.15) v1(68.51,23.8) v1(68.51,22.36) v1(69.54,3.81) v1(69.54,2.37) v1(69.86,97.53) v1(69.86,96.09) v1(69.86,23.74) v1(69.86,22.31) v1(71.31,97.53) v1(71.31,96.09) v1(71.31,23.74) v1(71.31,22.31) v1(73.15,15.67) v1(73.15,14.24) v1(73.41,87.77) v1(73.41,86.32) v1(74.6,15.67) v1(74.6,14.24) v1(75.18,87.77) v1(75.18,86.32) v1(75.96,15.62) v1(75.96,14.18) v1(77.41,15.62) v1(77.41,14.18) v1(78.03,61.84) v1(78.03,60.39) v1(77.98,59.03) v1(77.98,57.58) v1(79.41,59.03) v1(79.41,57.58) v1(79.47,61.84) v1(79.47,60.39) v1(83.82,62.15) v1(83.82,60.72) v1(84.46,3.61) v1(84.46,2.17) v1(85.2,55.27) v1(85.2,53.82) v1(85.27,62.15) v1(85.27,60.72) v1(85.26,58.08) v1(85.26,56.62) v1(85.91,3.61) v1(85.91,2.17) v1(86.23,37.06) v1(86.23,35.61) v1(86.29,39.87) v1(86.29,38.42) v1(86.62,62.1) v1(86.62,60.66) v1(86.64,55.27) v1(86.64,53.82) v1(86.69,58.08) v1(86.69,56.62) v1(87.26,3.55) v1(87.26,2.11) v1(87.5,23.29) v1(87.5,21.85) v1(87.73,39.87) v1(87.73,38.42) v1(87.67,37.06) v1(87.67,35.61) v1(88.08,62.1) v1(88.08,60.66) v1(88.33,97.56) v1(88.33,96.12) v1(88.71,3.55) v1(88.71,2.11) v1(88.96,23.29) v1(88.96,21.85) v1(89.78,97.56) v1(89.78,96.12) v1(90.31,23.24) v1(90.31,21.8) v1(91.13,97.5) v1(91.13,96.06) v1(91.76,23.24) v1(91.76,21.8) v1(92.58,97.5) v1(92.58,96.06) v1(93.47,16.69) v1(93.47,15.25) v1(93.85,12.37) v1(93.85,10.93) v1(94.93,16.69) v1(94.93,15.25) v1(95.31,12.37) v1(95.31,10.93) v1(96.28,16.63) v1(96.28,15.2) v1(96.66,12.31) v1(96.66,10.88) v1(97.73,16.63) v1(97.73,15.2) v1(98.11,12.31) v1(98.11,10.88)
AIN1: length 102.6
  Top Layer w0.254: v1(53.92,80.47) 39.15,80.47 U1.21 38.1,80.31 36.83,79.05 29.03,79.05 J2.1
  Bottom Layer w0.254: U35.1 49.2,9.41 49.2,13.86 52.8,13.86 53.9,14.96 53.9,80.45 v1(53.92,80.47)
AIN2: length 101.6
  Top Layer w0.254: v1(53.3,81.22) 39.99,81.22 39.5,81.71 37.08,81.71 36.45,81.08 U1.1 J1.1
  Bottom Layer w0.254: U35.2 46.66,9.37 H20.2 46.66,15.29 46.84,15.47 52.63,15.47 53.34,16.18 53.34,81.18 v1(53.3,81.22)
BIN1: length 90
  Top Layer w0.254: 28.19,65.08 29.61,65.08 30.67,64.01 36.85,64.01 37.92,65.08 U1.27 39.62,65.71 v1(52.76,65.71)
  Bottom Layer w0.254: U35.3 44.12,9.33 H20.3 44.32,14.07 44.32,15.16 44.99,15.83 52.1,15.83 52.83,16.56 52.83,65.63 v1(52.76,65.71)
BIN2: length 88.3
  Top Layer w0.254: J1.7 U1.7 37.72,66.34 v1(51.94,66.34)
  Bottom Layer w0.254: v1(51.94,66.34) 52.17,66.12 52.17,16.92 51.56,16.31 42.34,16.31 41.58,15.54 41.58,9.29 U35.4
CAN1_RX: length 85.1
  Top Layer w0.254: J3.16 75.69,42.22 73.77,42.22 72.71,41.15 66.53,41.15 65.46,42.22 U1.56 ; R1.1 46.98,91.36 H15.2 46.75,92.62 CN17.1
  Bottom Layer w0.254: U1.56 64.26,42.09 62.84,42.09 62.59,42.34 62.59,91.39 61.09,92.89 48.51,92.89 H15.2
CAN1_TX: length 85
  Top Layer w0.254: R1.2 45.47,91.36 H15.1 45.5,92.42 45.5,94.85 ; U1.71 72.26,54.92 J4.11
  Bottom Layer w0.254: H15.1 44.96,92.63 45.72,93.4 50.06,93.4 50.24,93.58 50.24,95.76 50.42,95.94 51.58,95.94 51.76,95.76 51.76,93.58 51.94,93.4 53.11,93.4 53.29,93.58 53.29,95.76 53.47,95.94 54.63,95.94 54.81,95.76 54.81,93.58 54.99,93.4 56.16,93.4 56.34,93.58 56.34,95.76 56.51,95.94 57.68,95.94 57.86,95.76 57.86,93.58 58.04,93.4 61.59,93.4 62.99,92 62.99,56.21 63.25,55.96 65.89,55.96 U1.71
CAN2_RX: length 67.3
  Top Layer w0.254: U1.35 37.92,44.76 36.85,43.69 30.67,43.69 29.61,44.76 28.19,44.76 ; CN64.1 39.9,92.64 40.54,91.99 H16.2 40.47,91.83 40,91.36 R2.1
  Bottom Layer w0.254: U1.35 39.09,44.86 40.54,44.86 40.79,45.11 40.79,86.13 39.47,87.45 39.47,90.76 H16.2
CAN2_TX: length 67.3
  Top Layer w0.254: CN64.2 38.64,92.65 38,92 H16.1 38.49,91.33 R2.2 ; U1.15 J1.15
  Bottom Layer w0.254: H16.1 39.07,90.76 39.07,87.1 40.39,85.78 40.39,84.84 40.21,84.66 38.03,84.66 37.85,84.48 37.85,83.31 38.03,83.13 40.21,83.13 40.39,82.95 40.39,46.15 40.13,45.9 38.66,45.9 38.02,45.26 36.53,45.26 36.45,45.18 U1.15
CIN1: length 87.2
  Top Layer w0.254: v1(51.36,60.25) 38.86,60.25 38.6,60 ; 38.6,60 U1.29 ; 38.6,60 37.92,60 36.85,58.93 30.67,58.93 29.61,60 28.19,60
  Bottom Layer w0.254: v1(51.36,60.25) 51.36,17.5 50.67,16.81 39.5,16.81 39.04,16.36 H20.5 39.04,13.86 U35.5
CIN2: length 85.4
  Top Layer w0.254: v1(50.72,61.01) 39.45,61.01 39.42,61.04 38.56,61.04 38.53,61.01 37.46,61.01 U1.9 J1.9
  Bottom Layer w0.254: v1(50.72,61.01) 50.72,18.01 50.04,17.32 36.96,17.32 36.5,16.87 H20.6 36.5,9.3 U35.6
DIN1: length 114
  Top Layer w0.254: v1(50.04,74.47) 63.12,74.47 63.5,74.09 65.53,74.09 U1.64 68.06,72.7 68.07,72.69 J4.4
  Bottom Layer w0.254: U36.1 23.67,9.4 H19.1 23.67,17.37 24,17.7 49.28,17.7 50.04,18.47 v1(50.04,74.47)
DIN2: length 118.4
  Top Layer w0.254: v1(49.4,72.95) 64.14,72.95 U1.44 65.46,72.7 66.53,71.63 72.71,71.63 73.77,72.69 J3.4
  Bottom Layer w0.254: U36.2 21.13,9.36 H19.2 21.13,17.37 21.97,18.21 48.64,18.21 49.4,18.97 v1(49.4,72.95)
KEY1: length 77.8
  Top Layer w0.254: v1(69.22,86.72) 69.16,86.67 34.24,86.67 33.99,86.41 33.99,85.48 33.01,84.51 13.84,84.51 13.46,84.89 R6_1k1.1 ; J4.3 69.12,75.23 69.12,75.24 U1.63
  Bottom Layer w0.254: v1(69.22,86.72) 69.22,76.12 68.58,75.49 67.18,75.49 U1.63
KEY2: length 75.6
  Top Layer w0.254: 75.69,75.24 74.17,75.24 72.9,73.97 66.73,73.97 65.46,75.24 U1.43 ; v1(65.53,87.53) 65.51,87.55 34.04,87.55 33.63,87.15 33.63,85.63 32.89,84.89 19.43,84.89 19.23,85.09 R7_1K1.1
  Bottom Layer w0.254: v1(65.53,87.53) 65.53,75.36 65.35,75.18 64.44,75.18 U1.43
KEY3: length 62.1
  Top Layer w0.254: J4.2 70.17,77.78 70.17,77.78 U1.62 ; v1(67.94,88.11) 33.71,88.11 33.27,87.68 33.27,85.9 32.77,85.39 25.4,85.39 25.07,85.72 R8_1K1.1
  Bottom Layer w0.254: U1.62 67.94,78.79 67.94,79.86 67.97,79.89 67.97,80.75 67.94,80.77 v1(67.94,88.11)
KEY4: length 77.1
  Top Layer w0.254: v1(71.12,88.7) 33.4,88.7 32.89,88.19 32.89,86.92 32.46,86.49 R31_1K1.1 ; U1.68 72.26,62.54 J4.8
  Bottom Layer w0.254: U1.68 70.36,62.54 71.12,63.3 v1(71.12,88.7)
LED1: length 60.8
  Top Layer w0.254: v1(61.85,89.71) 61.85,90.73 61.34,91.24 60.07,91.24 59.44,91.87 59.44,93.4 59.31,93.52 R13_2K1.1 ; 28.19,70.16 29.61,70.16 30.67,69.09 36.85,69.09 37.92,70.16 U1.25 v1(61.85,70.16)
  Bottom Layer w0.254: v1(61.85,70.16) v1(61.85,89.71)
LED2: length 67.9
  Top Layer w0.254: R10_2K1.1 60.07,90.86 v1(60.96,89.97) ; 28.19,57.46 29.61,57.46 30.67,56.39 36.85,56.39 37.92,57.46 U1.30 41.02,59.49 v1(60.96,59.49)
  Bottom Layer w0.254: v1(60.96,59.49) 60.97,59.5 60.97,89.96 v1(60.96,89.97)
M1_ENCODER_A: length 86.1
  Top Layer w0.254: J4.17 72.26,39.68 U1.77 65.53,41.07 63.63,41.07 63.12,41.58 v1(48.77,41.58)
  Bottom Layer w0.254: v1(48.77,41.58) 48.77,19.35 48.13,18.72 19.18,18.72 18.59,18.13 H19.3 18.59,9.32 U36.3
M1_ENCODER_B: length 95.9
  Top Layer w0.254: v1(48.13,56.31) 37.84,56.31 U1.11 J1.11
  Bottom Layer w0.254: v1(48.13,56.31) 48.13,19.99 47.37,19.23 16.76,19.23 16.05,18.52 H19.4 16.05,9.28 U36.4
M2_ENCODER_A: length 116.8
  Top Layer w0.254: J4.7 72.26,65.08 U1.67 65.53,66.47 63.25,66.47 62.48,67.23 v1(47.5,67.23)
  Bottom Layer w0.254: U36.5 13.51,9.26 H19.5 13.39,13.99 13.39,18.52 14.48,19.61 46.86,19.61 47.5,20.24 v1(47.5,67.23)
M2_ENCODER_B: length 121.1
  Top Layer w0.254: v1(46.86,65.13) 64.34,65.13 U1.47 65.46,65.08 66.53,64.01 72.71,64.01 73.77,65.08 J3.7
  Bottom Layer w0.254: U36.6 10.97,9.3 H19.6 10.97,19.66 11.3,19.99 46.48,19.99 46.86,20.37 v1(46.86,65.13)
M3_ENCODER_A: length 64.6
  Top Layer w0.254: J1.19 36.45,34.6 37.72,35.86 v1(60.58,35.86)
  Bottom Layer w0.254: v1(60.58,35.86) 60.58,16.43 60.83,16.18 68.58,16.18 69.6,15.16 H18.1 69.6,9.6 CN62.1
M3_ENCODER_B: length 64.8
  Top Layer w0.254: 28.19,34.6 29.61,34.6 30.67,33.53 36.85,33.53 37.92,34.6 38.99,34.6 39.37,34.98 v1(59.94,34.98)
  Bottom Layer w0.254: CN62.2 67.06,9.56 H18.2 67.06,15.16 66.42,15.8 60.2,15.8 59.94,16.05 v1(59.94,34.98)
M4_ENCODER_A: length 102.7
  Top Layer w0.254: v1(59.18,75.36) 39.11,75.36 U1.23 37.92,75.24 36.85,74.17 30.67,74.17 29.61,75.24 28.19,75.24
  Bottom Layer w0.254: CN62.3 64.53,13.88 H18.3 64.52,15.04 64.26,15.29 59.56,15.29 59.18,15.67 v1(59.18,75.36)
M4_ENCODER_B: length 97.5
  Top Layer w0.254: v1(58.42,76.25) 58.39,76.28 37.49,76.28 U1.3 J1.3
  Bottom Layer w0.254: CN62.4 62.03,13.84 H18.4 59.31,13.89 58.5,14.71 58.5,76.17 v1(58.42,76.25)
PES1: length 113.7
  Top Layer w0.254: 28.19,49.84 29.61,49.84 30.67,48.77 36.85,48.77 37.92,49.84 U1.33 ; v1(24.68,27.36) 89.28,27.36 90.04,28.12 90.04,36.25 90.81,37.01 H7.1
  Bottom Layer w0.254: v1(24.68,27.36) 24.68,49.11 25.4,49.83 J2.13
PES2: length 125.7
  Top Layer w0.254: U1.31 37.92,54.92 36.85,53.85 30.67,53.85 29.61,54.92 28.19,54.92 ; v1(22.89,28.52) 88.67,28.52 89.28,29.13 89.28,42.72 89.92,43.36 H8.1
  Bottom Layer w0.254: v1(22.89,28.52) 22.89,50.38 24.26,51.74 26.16,51.74 26.54,52.12 26.54,54.53 26.93,54.92 J2.11
PES3: length 26.6
  Top Layer w0.254: H9.1 92.28,46.03 73.53,46.03 J4.15 72.26,44.76 U1.75
PES4: length 92.3
  Top Layer w0.254: v1(37.08,84.89) 79.38,84.89 80.49,83.77 80.49,75.9 81.53,74.85 82.93,74.85 83.82,73.97 83.82,69.52 84.58,68.76 91.95,68.76 92.79,67.91 H10.1 ; 28.19,77.78 29.61,77.78 30.67,76.71 36.85,76.71 37.92,77.78 U1.22
  Bottom Layer w0.254: v1(37.08,84.89) 37.08,81.58 37.72,80.95 37.72,78.54 38.48,77.78 U1.22
PES5: length 89.6
  Top Layer w0.254: U1.2 J1.2 ; H11.1 91.82,62.3 91.64,62.48 91.64,67.41 90.81,68.25 84.46,68.25 83.44,69.27 83.44,73.71 82.65,74.5 81.39,74.5 80.14,75.75 80.14,83.49 79.35,84.28 35.48,84.28 v1(35.31,84.45)
  Bottom Layer w0.254: v1(35.31,84.45) 35.31,78.16 35.69,77.78 U1.2
PES6: length 120.2
  Top Layer w0.254: v1(23.48,27.94) 88.98,27.94 89.66,28.63 89.66,39.42 90.42,40.18 H12.1 ; U1.32 37.92,52.38 36.85,51.31 30.67,51.31 29.61,52.38 28.19,52.38
  Bottom Layer w0.254: v1(23.48,27.94) 23.48,50.2 24.51,51.23 24.52,51.23 24.54,51.26 27.33,51.26 27.76,51.68 J2.12
PES7: length 111.7
  Top Layer w0.254: v1(24.09,26.61) 24.14,26.66 89.47,26.66 90.42,27.61 90.42,33.2 91.19,33.96 H13.1 ; U1.13 J1.13
  Bottom Layer w0.254: v1(24.09,26.61) 24.09,50.18 24.82,50.9 28.2,50.9 28.76,50.34 30.61,50.34 J1.13
PWMA: length 82.6
  Top Layer w0.254: v1(82.37,64.64) 80.32,64.64 79.88,65.08 79.88,69.9 78.56,71.22 73.33,71.22 J4.5 72.26,70.16 U1.65
  Bottom Layer w0.254: v1(82.37,64.64) 82.45,64.55 82.45,40.03 83.62,38.86 83.62,17.4 84.33,16.69 89.28,16.69 90.04,15.93 H17.1 90.04,9.59 CN61.1
PWMB: length 82.5
  Top Layer w0.254: U1.45 65.46,70.16 66.53,69.09 72.71,69.09 73.77,70.16 J3.5 78.87,70.16 79.38,69.65 79.38,64.44 79.88,63.93 v1(81.86,63.93)
  Bottom Layer w0.254: v1(81.86,63.93) 81.86,39.98 83.26,38.58 83.26,16.74 83.82,16.18 86.87,16.18 87.5,15.54 H17.2 87.5,9.55 CN61.2
PWMC: length 46.7
  Top Layer w0.254: v1(82.68,38.28) 73.41,38.28 J4.18 72.26,37.14 U1.78
  Bottom Layer w0.254: v1(82.68,38.28) 82.68,16.18 83.19,15.67 84.58,15.67 84.96,15.29 H17.3 84.96,9.55 CN61.3
PWMD: length 46.3
  Top Layer w0.254: U1.58 65.46,37.14 66.53,36.07 72.71,36.07 73.77,37.14 75.69,37.14 J3.18 81.91,37.14 v1(82.04,37.01)
  Bottom Layer w0.254: CN61.4 82.48,13.83 H17.4 82.04,14.28 v1(82.04,37.01)
RX1: length 97.6
  Top Layer w0.254: v1(57.28,4.88) 18.67,4.88 17.72,5.83 17.72,9.34 CN69.4 ; v1(57.28,43.36) 65.79,43.36 U1.76 72.26,42.22 J4.16
  Bottom Layer w0.254: v1(57.28,4.88) v1(57.28,43.36)
RX2: length 98.1
  Top Layer w0.254: J3.9 73.77,60 72.71,58.93 66.53,58.93 65.46,60 U1.49 64.01,60.38 v1(55.93,60.38) ; CN65.4 35.85,6.62 36.32,6.15 v1(55.88,6.15)
  Bottom Layer w0.254: v1(55.88,6.15) 55.93,6.2 v1(55.93,60.38)
RX3: length 58.7
  Top Layer w0.254: CN66.4 53.85,11.23 55.25,12.62 v1(55.25,13.39) ; v1(55.25,39.67) 38.99,39.67 U1.37 37.92,39.68 36.85,38.61 30.67,38.61 29.61,39.68 28.19,39.68
  Bottom Layer w0.254: v1(55.25,13.39) v1(55.25,39.67)
RX4: length 73.3
  Top Layer w0.254: CN67.4 89.86,7.48 90.42,6.91 v1(91.19,6.91) ; U1.53 65.46,49.84 66.53,48.77 72.71,48.77 73.77,49.84 75.69,49.84 J3.13 v1(84.46,49.83)
  Bottom Layer w0.254: v1(91.19,6.91) 91.17,6.92 91.17,16.05 90.03,17.2 84.84,17.2 84.46,17.58 v1(84.46,49.83)
RX5: length 75.6
  Top Layer w0.254: v1(80.52,6.91) 72.14,6.91 72.01,7.04 72.01,9.31 CN68.4 ; U1.51 65.46,54.92 66.53,53.85 72.71,53.85 73.77,54.92 75.69,54.92 J3.11
  Bottom Layer w0.254: J3.11 79.63,54.92 80.57,53.97 80.57,6.96 v1(80.52,6.91)
RX6: length 99.5
  Top Layer w0.254: 64.39,34.6 65.46,34.6 66.53,33.53 72.71,33.53 73.77,34.6 75.69,34.6 J3.19 v1(79.12,34.59) ; CN70.4 79.1,20.3 v1(79.12,20.32)
  Bottom Layer w0.254: v1(79.12,20.32) v1(79.12,34.59)
SCL: length 41
  Top Layer w0.254: v1(78.69,68.76) 73.41,68.76 J4.6 72.26,67.62 U1.66
  Bottom Layer w0.254: v1(78.69,68.76) 78.69,97.38 U31.3
SCL2: length 82.4
  Top Layer w0.254: 28.19,47.3 29.61,47.3 30.67,46.23 36.85,46.23 37.92,47.3 U1.34 39.53,47.84 57.7,47.84 v1(57.78,47.75) ; v1(60.32,92.25) 60.32,95.17 H14.3
  Bottom Layer w0.254: v1(57.78,47.75) 57.84,47.81 57.84,76.49 60.02,78.68 60.02,90.99 60.32,91.3 v1(60.32,92.25)
SDA: length 45.8
  Top Layer w0.254: U1.46 65.46,67.62 66.53,66.55 72.71,66.55 73.77,67.61 J3.6 v1(78.1,67.61)
  Bottom Layer w0.254: v1(78.1,67.61) 78.1,94.79 77.6,95.3 76.71,95.3 76.07,95.94 U31.4
SDA2: length 79
  Top Layer w0.254: H14.4 61.09,96.95 v1(61.09,91.87) ; v1(59.82,48.31) 59.79,48.34 37.49,48.34 U1.14 J1.14
  Bottom Layer w0.254: v1(59.82,48.31) 60.38,48.87 60.38,90.84 61.09,91.56 v1(61.09,91.87)
SERVO1: length 51.1
  Top Layer w0.254: 64.33,77.67 65.39,77.67 66.46,76.61 73.1,76.61 74.17,77.67 74.59,77.67 74.59,77.67 75.63,77.67 ; v1(89.71,52.88) 89.66,52.93 89.66,66.47 89.41,66.73 83.82,66.73 81.91,68.63 81.91,72.69 81.53,73.08 80.77,73.08 78.61,75.23 78.61,77.27 78.23,77.65 75.82,77.65 J3.2
  Bottom Layer w0.254: v1(89.71,52.88) H3.3
SERVO2: length 54.8
  Top Layer w0.254: U1.61 72.26,80.32 J4.1 72.26,81.2 72.64,81.58 78.77,81.58 79.02,81.33 79.02,75.36 80.94,73.43 81.95,73.43 82.32,73.06 82.32,68.74 83.93,67.13 90.15,67.13 90.45,66.83 90.45,56.29 90.81,55.94 90.81,52.38 92.79,50.39 H4.3
SERVO3: length 97.7
  Top Layer w0.254: U1.36 37.92,42.22 36.85,41.15 30.67,41.15 29.61,42.22 28.19,42.22 ; 92.96,27.74 92.79,27.74 90.51,25.45 v1(26.03,25.45)
  Bottom Layer w0.254: v1(26.03,25.45) 26.03,41.58 26.67,42.22 J2.16
SERVO4: length 99.3
  Top Layer w0.254: v1(25.44,26.03) 89.54,26.03 90.93,27.43 90.93,30.28 91.44,30.78 92.58,30.78 H6.3 ; U1.16 J1.16
  Bottom Layer w0.254: v1(25.44,26.03) 25.44,42.51 26.29,43.36 28.12,43.36 29.27,42.22 J1.16
T13C1: length 117.4
  Top Layer w0.254: H23.3 91.44,59.23 91.19,59.49 91.19,67.23 90.55,67.87 84.33,67.87 83.08,69.12 83.08,73.56 82.5,74.14 81.24,74.14 79.76,75.63 79.76,83.11 79.12,83.74 25.81,83.74 v1(25.76,83.8) ; U1.26 37.92,67.62 36.85,66.55 30.67,66.55 29.61,67.62 28.19,67.62
  Bottom Layer w0.254: v1(25.76,83.8) 25.76,69.61 J2.6
T14C1: length 108.9
  Top Layer w0.254: U1.6 J1.6 ; 92.84,56.06 91.19,56.06 90.81,56.44 90.81,66.98 90.3,67.49 84.07,67.49 82.68,68.89 82.68,73.2 82.09,73.79 81.09,73.79 79.38,75.5 79.38,82.86 79.12,83.11 v1(29.84,83.11)
  Bottom Layer w0.254: J1.6 30.48,67.62 29.84,68.25 v1(29.84,83.11)
TIM2C1: length 44.6
  Top Layer w0.254: U1.24 37.92,72.7 36.85,71.63 30.67,71.63 29.61,72.7 28.19,72.7
  Bottom Layer w0.254: CN77.4 9.61,89.2 24,89.2 26.47,86.74 26.47,73.28 27.05,72.7 J2.4
TIM2C2: length 28.6
  Top Layer w0.254: v1(12.19,73.33) 14.99,73.33 15.62,73.97 29.85,73.97 J1.4 U1.4
  Bottom Layer w0.254: v1(12.19,73.33) 12.19,72.44 11.75,72 CN79.4
TIM2C3: length 51.3
  Top Layer w0.254: U1.5 J1.5 29.85,71.42 6.6,71.42 5.46,70.28 5.46,55.55 v1(6.41,54.6)
  Bottom Layer w0.254: v1(6.41,54.6) 9.67,54.6 CN78.4
TIM2C4: length 93.6
  Top Layer w0.254: v1(22.22,63.6) 30.47,63.6 30.53,63.65 37,63.65 37.08,63.73 40.13,63.73 41.33,62.54 U1.48 65.46,62.54 66.53,61.47 72.71,61.47 73.77,62.53 J3.8
  Bottom Layer w0.254: CN80.4 9.66,37.21 21.54,37.21 22.22,37.9 v1(22.22,63.6)
TRIGGER1: length 81.8
  Top Layer w0.254: U1.18 J1.18 ; v1(29.97,56.06) v1(16.38,56.06)
  Bottom Layer w0.254: J1.18 33.78,37.14 34.29,37.64 34.29,55.42 33.66,56.06 v1(29.97,56.06) ; v1(16.38,56.06) 16.38,86.03 15.64,86.77 CN77.3
TRIGGER2: length 61.4
  Top Layer w0.254: 28.19,37.14 29.61,37.14 30.67,36.07 36.85,36.07 37.92,37.14 U1.38 ; J2.18 16.76,37.14 16,37.9 16,55.61 15.8,55.82 15.8,56.3 16,56.5 16,68.76 v1(15.37,69.39)
  Bottom Layer w0.254: CN79.3 9.78,69.39 v1(15.37,69.39)
TRIGGER3: length 80.7
  Top Layer w0.254: v1(21.53,38.15) 27.26,38.15 27.31,38.2 28.2,38.2 28.25,38.15 30.62,38.15 30.67,38.2 31.56,38.2 31.61,38.15 35.99,38.15 36.02,38.18 36.88,38.18 36.91,38.15 38.53,38.15 38.56,38.18 39.42,38.18 39.45,38.15 40,38.15 40.26,37.9 40.26,36.88 40.51,36.63 60.71,36.63 61.16,36.17 61.16,36.11 61.16,36.11 61.16,35.62 61.16,35.62 61.16,33.38 61.34,33.2 65.79,33.2 U1.80 72.26,32.06 J4.20
  Bottom Layer w0.254: CN78.3 9.69,52.12 20.19,52.12 21.53,50.79 v1(21.53,38.15)
TRIGGER4: length 69.7
  Top Layer w0.254: v1(11.94,34.85) 11.94,33.71 12.52,33.12 42.24,33.12 44.32,31.04 63.37,31.04 U1.60 65.46,32.06 66.53,30.99 72.71,30.99 73.77,32.06 75.69,32.06 J3.20
  Bottom Layer w0.254: CN80.3 11.92,34.83 v1(11.94,34.85)
TX1: length 100.5
  Top Layer w0.254: 15.22,8.83 15.22,6.04 17.02,4.24 57.94,4.24 v1(58.04,4.34) ; J3.17 75.69,39.68 73.77,39.68 72.71,38.61 66.53,38.61 65.46,39.68 U1.57 v1(57.91,39.67)
  Bottom Layer w0.254: v1(58.04,4.34) 57.91,4.46 v1(57.91,39.67)
TX2: length 98.3
  Top Layer w0.254: 33.35,9.47 33.35,6.33 34.16,5.51 v1(56.51,5.51) ; v1(56.51,61.01) 56.54,61.04 65.89,61.04 U1.69 72.26,60 J4.9
  Bottom Layer w0.254: v1(56.51,5.51) v1(56.51,61.01)
TX3: length 57.6
  Top Layer w0.254: J1.17 U1.17 37.67,40.89 v1(54.48,40.89) ; v1(54.48,13.39) 54.48,12.75 53.34,11.61 51.69,11.61 51.35,11.27 CN66.3
  Bottom Layer w0.254: v1(54.48,13.39) v1(54.48,40.89)
TX4: length 76.4
  Top Layer w0.254: v1(91.82,6.02) 88.01,6.02 87.36,6.68 CN67.3 ; v1(85.09,50.47) 76.57,50.47 76.13,50.9 73.33,50.9 J4.13 72.26,49.84 U1.73
  Bottom Layer w0.254: v1(91.82,6.02) 91.77,6.07 91.77,15.96 90.15,17.58 85.34,17.58 85.04,17.88 85.04,50.42 v1(85.09,50.47)
TX5: length 73.7
  Top Layer w0.254: v1(79.88,6.15) 70.23,6.15 69.35,7.02 CN68.3 ; J4.12 72.26,52.38 U1.72
  Bottom Layer w0.254: v1(79.88,6.15) 79.88,52.76 79.12,53.52 73.41,53.52 J4.12
TX6: length 96.8
  Top Layer w0.254: v1(78.46,35.99) 73.79,35.99 72.39,34.59 J4.19 72.26,34.6 66.93,34.6 ; v1(78.46,21.08) 78.33,20.96 13.89,20.96 12.05,22.8 CN70.3
  Bottom Layer w0.254: v1(78.46,21.08) v1(78.46,35.99)
USER1_A: length 4.2
  Top Layer w0.381: CN72.1 13.62,64.09 H21.1
USER1_B: length 4.2
  Top Layer w0.381: CN72.2 13.66,61.59 H21.2
USER1_C: length 4.2
  Top Layer w0.381: CN72.3 13.7,59.09 H21.3
USER1_D: length 4.2
  Top Layer w0.381: H21.4 13.74,56.59 CN72.4
USER2_A: length 4.4
  Top Layer w0.381: CN73.1 13.94,46.18 H22.1
USER2_B: length 4.4
  Top Layer w0.381: H22.2 13.9,43.68 CN73.2
USER2_C: length 4.4
  Top Layer w0.381: H22.3 13.86,41.18 CN73.3
USER2_D: length 4.5
  Top Layer w0.381: CN73.4 13.82,38.68 H22.4
USER3_A: length 4.3
  Top Layer w0.381: CN75.1 13.72,81.97 H26.1
USER3_B: length 4.3
  Top Layer w0.381: CN75.2 13.77,79.47 H26.2
USER3_C: length 4.3
  Top Layer w0.381: H26.3 13.81,76.97 CN75.3
USER3_D: length 4.2
  Top Layer w0.381: H26.4 13.84,74.47 CN75.4
$1N365: length 12.2
  Top Layer w0.254: U1.54 65.46,47.3 66.53,46.23 72.71,46.23 73.77,47.3 75.69,47.3 J3.14
$1N367: length 12.2
  Top Layer w0.254: U1.55 65.46,44.76 66.53,43.69 72.71,43.69 73.77,44.76 75.69,44.76 J3.15
$1N369: length 5.3
  Top Layer w0.254: U1.74 72.26,47.3 J4.14
$1N397: length 12.2
  Top Layer w0.254: 75.69,80.32 74.65,80.32 73.58,79.25 73.17,79.25 73.17,79.25 66.53,79.25 65.46,80.32 U1.41
$1N415: length 5.3
  Top Layer w0.254: U1.10 J1.10
$1N423: length 5.3
  Top Layer w0.254: U1.12 J1.12
$1N429: length 11.7
  Top Layer w0.254: U1.28 37.92,62.54 36.85,61.47 30.67,61.47 29.61,62.54 28.19,62.54
$1N431: length 5.3
  Top Layer w0.254: U1.8 J1.8
$1N459: length 12.2
  Top Layer w0.254: J3.12 75.69,52.38 73.77,52.38 72.71,51.31 66.53,51.31 65.46,52.38 U1.52
$1N465: length 12.2
  Top Layer w0.254: U1.50 65.46,57.46 66.53,56.39 72.71,56.39 73.77,57.46 75.69,57.46 J3.10
$1N5729: length 5.3
  Top Layer w0.254: U1.70 72.26,57.46 J4.10
$1N6571: length 4.5
  Top Layer w0.254: C1.1 13.14,88.38 R6_1k1.2 13.59,88.83 key1.1
$1N6572: length 4.7
  Top Layer w0.254: C56.1 19,88.25 R7_1K1.2 key2.1
$1N6573: length 4.8
  Top Layer w0.254: C57.1 24.72,88.13 R8_1K1.2 key3.1
$1N6581: length 4.9
  Top Layer w0.254: C58.1 30.61,88.13 R31_1K1.2 key4.1
$1N6590: length 2.2
  Top Layer w0.254: 56.24,90.73 54.23,90.73 LED2.1
$1N6594: length 2.2
  Top Layer w0.254: 56.24,93.4 54.23,93.4 LED1.1
$1N12392: length 2.4
  Top Layer w0.254: R10_10K1.2 3V1.1
$1N12395: length 2.4
  Top Layer w0.254: R13_10K1.2 5V1.1

## Copper pours and planes (outline as drawn; the poured copper is in the pictures)
3V3 on Top Layer: 77.72,89.59 81.66,89.59 81.66,85.52 77.72,85.52
5V on Top Layer: 79.5,95.68 84.15,95.68 84.15,92.88 79.5,92.88
GND on Top Layer: -6.6,106.86 108.2,106.86 108.2,-6.3 -6.6,-6.3
GND on Bottom Layer: -15.11,115.11 117.22,115.11 117.22,-9.98 -15.11,-9.98
$1N768 on Top Layer: 80.9,87.81 99.49,87.81 99.49,74.85 80.9,74.85
$1N1772 on Top Layer: 81.98,93.9 98.43,93.9 98.43,88.23 81.98,88.23

Small or netless copper shapes (teardrops, artwork), in the pictures only: 463 on Top Layer, 237 on Bottom Layer

## Text on the board
Bottom Silkscreen Layer: 5V | M2EB | G | TR | M2EA | T12C1 | T12C2 | T12C4 | T12C3 | M1EB | 104 | M1EA | DIN2 | DIN1 | CIN2 | CIN1 | BIN2 | BIN1 | AIN2 | AIN1 | M4EB | M4EA | M3EB | M3EA | PWMD | PWMC | PWMB | PWMA | 超声波4 | 超声波1 | 超声波3 | 超声波2
Top Silkscreen Layer: 1k | 104 | CAN2 | CAN1 | G | 3v3 | 2K | SCL2 | SDA2 | SDA | 10K | SCL | F1206 | 3V3 | 5V | PES4 | PES5 | SERVO4 | PES1 | PES7 | PES2 | PES6 | SERVO1 | PES3 | SERVO3 | T13C1 | T14C1 | SERVO2 | RX | TX | A | B | C | D | M4EA | T2C1 | AIN1 | LED1 | LED2 | M3EB | BIN1 | CIN1 | TR2 | P2 | P6 | RX3 | P1 | S3 | T2C2 | M1EB | M4EB | M3EA | CIN2 | AIN2 | BIN2 | TX3 | TR1 | P7 | S4 | PWMA | RX1 | CAN1T | TX4 | P3 | M1EA | DIN1 | M2EA | TX6 | PWMC | TX5 | TR3 | TX2 | K4 | S2 | K3 | K1 | T2C4 | CAN1R | DIN2 | PWMB | K2 | RX5 | S1 | M2EB | RX2 | PWMD | TX1 | RX6 | TR4 | UART6 | UART1 | UART2 | UART3 | UART5 | UART4 | by gqw / v1.1 | 终端电阻 | 自定义接口 | 外侧排针 | 内侧排针 | 排母对应关系 | 内侧接口 | 外侧接口 | USB口
